# Altium schematic sheet Programacion ICSP.SchDoc
size Legal; SheetNumber: 4; SheetTotal: 8
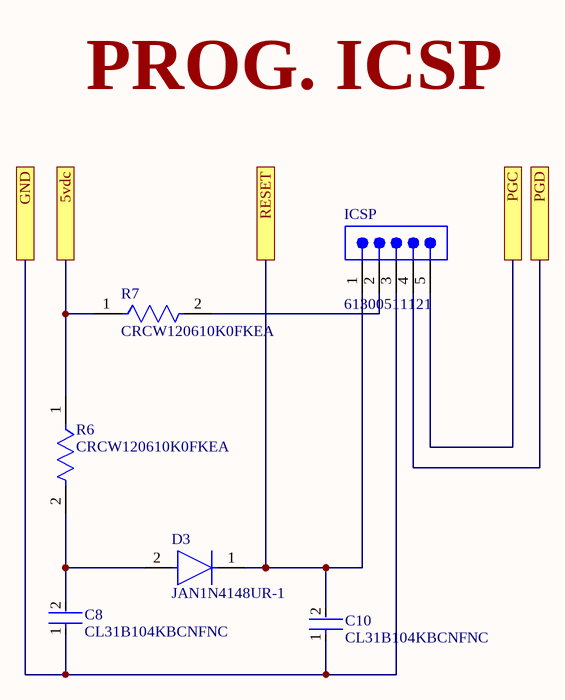
[diagram p0: Programacion ICSP.SchDoc]

## Parts
C8  CL31B104KBCNFNC  [FP-CL31-IPC_C]
C10  CL31B104KBCNFNC  [FP-CL31-IPC_C]
D3  JAN1N4148UR-1  [FP-DO-213AA-MFG]
ICSP  61300511121  [61300511121]
R6  CRCW120610K0FKEA  [FP-CRCW1206-e3-IPC_C]
R7  CRCW120610K0FKEA  [FP-CRCW1206-e3-IPC_C]

## Ports
5vdc, GND, PGC, PGD, RESET

## Nets
5vdc: R6.1 R7.1 ; port 5vdc
GND: C8.1 C10.1 ICSP.3 ; port GND
PGC: ICSP.5 ; port PGC
PGD: ICSP.4 ; port PGD
RESET: C10.2 D3.1(C) ICSP.1 ; port RESET
NetC8_2: C8.2 D3.2(A) R6.2
NetICSP_2: ICSP.2 R7.2

## Notes on the sheet
- PROG. ICSP

## Library data of the parts
C8 C10 = CMP-13271-001276-1: Cap Ceramic 100nF 50V X7R ±10% SMD 1206 +125°C Embossed T/R; Dielectric: X7R; Case Code (Metric): 3216; Package Quantity: 1; Thickness: 0.037inch; Depth: 1.6mm; Packaging: Tape and Reel; Capacitance: 100nF; Length: 0.126inch; Tolerance: 10%; Voltage Rating: 50V; Case Code (Imperial): 1206; Radiation Hardening: No; Width: 0.063inch; Case/Package: 1206; Max Operating Temperature: 125°C; Min Operating Temperature: -55°C; Height: 0.85mm; Mount: Surface Mount
D3 = CMP-06359-000008-1: DIODE GEN PURP 100V 200MA DO213
ICSP = CMP-1502-01068-2: NexarPartId: 32855526; Operating Supply Voltage: 250V; Number of Contacts: 5; Connector Type: Male Pin; Current Rating: 3A; Contact Resistance: 20mΩ; Pitch: 2.54mm; Gender: Male; Termination: Solder; RoHS: Compliant; Lead Pitch: 2.54mm; Contact Mating Length: 5.9944mm; Number of Positions: 5; Lead Free: Lead Free; Contact Plating: Gold; Number of Pins: 5; Min Operating Temperature: -40°C; Voltage Rating: 250V; Color: Black; Mount: Through Hole; REACH SVHC: Unknown; Packaging: Bulk; Height: 8.89mm; Number of Rows: 1; Orientation: Vertical; Contact Material: Copper; Max Operating Temperature: 105°C
R6 R7 = CMP-2003-04807-2: RES Thick Film, 10kΩ, 1%, 0.25W, 100ppm/°C, 1206; Working Voltage: 200V; Max Power Dissipation: 250mW; Resistance: 10kR; Tolerance: 1%; Width: 0.063inch; Height: 0.55mm; Number of Pins: 2; Voltage Rating: 200V; Temperature Coefficient: 100ppm/°C; Military Standard: Not; Features: Automotive AEC-Q200; Depth: 1.6mm; Radiation Hardening: No; Termination: SMD/SMT; Case Code (Imperial): 1206; Weight: 0.000353oz; Length: 3.2mm; Package Quantity: 10; Voltage Rating (DC): 200V; Case/Package: 1206; Min Operating Temperature: -55°C; Number of Terminations: 2; Composition: Thick Film; Contact Plating: Tin; Power Rating: 250mW; Packaging: Tape and Reel; Max Operating Temperature: 155°C; Lead Free: Lead Free; Case Code (Metric): 3216